# Altium schematic sheet pic.SchDoc
size A; DrawnBy: cc
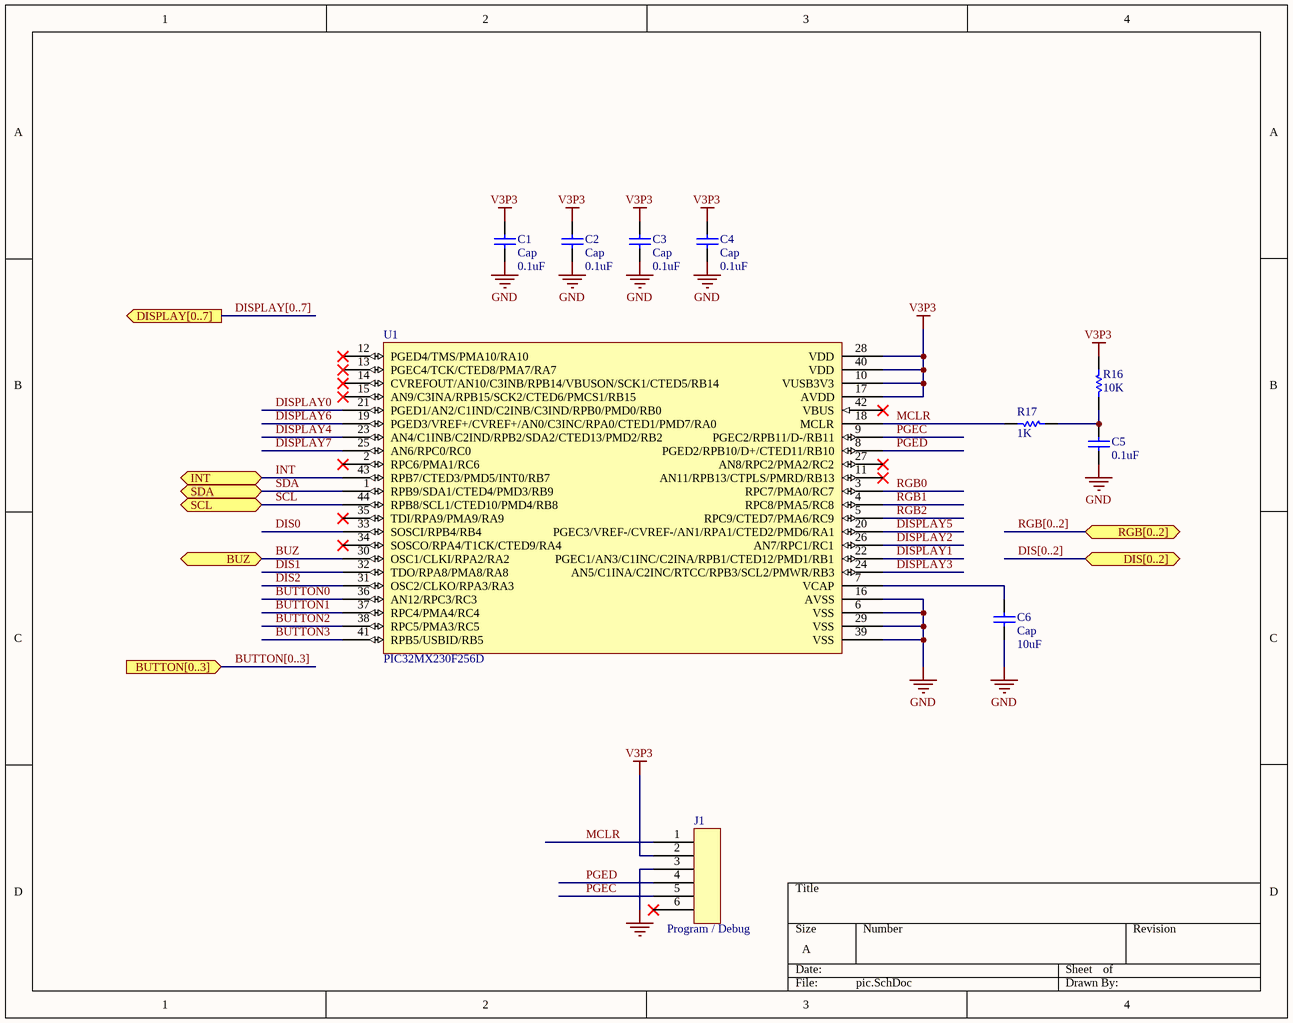
[diagram p0: pic.SchDoc]

## Parts
C1  Cap  value 0.1uF  [Capacitor]
C2  Cap  value 0.1uF  [Capacitor]
C3  Cap  value 0.1uF  [Capacitor]
C4  Cap  value 0.1uF  [Capacitor]
C5  value 0.1uF  [Capacitor]  (hidden comment: Cap)
C6  Cap  value 10uF  [Capacitor]
J1  Program / Debug  [ICSP]
R16  10K  [RESISTANCE]
R17  value 1K  [RESISTANCE]  (hidden comment: 10K)
U1  PIC32MX230F256D  [PIC32]

## Ports
BUTTON[0..3] (in), BUZ (bidir), DIS[0..2] (bidir), DISPLAY[0..7] (out), INT (bidir), RGB[0..2] (bidir), SCL (bidir), SDA (bidir)

## Nets
GND: C1.1 C2.1 C3.1 C4.1 C5.1 C6.1 J1.3 U1.6(VSS) U1.16(AVSS) U1.29(VSS) U1.39(VSS)
V3P3: C1.2 C2.2 C3.2 C4.2 J1.2 R16.2 U1.10(VUSB3V3) U1.17(AVDD) U1.28(VDD) U1.40(VDD)
BUTTON0: U1.36(AN12/RPC3/RC3)
BUTTON1: U1.37(RPC4/PMA4/RC4)
BUTTON2: U1.38(RPC5/PMA3/RC5)
BUTTON3: U1.41(RPB5/USBID/RB5)
BUZ: U1.30(OSC1/CLKI/RPA2/RA2) ; port BUZ
DIS0: U1.33(SOSCI/RPB4/RB4)
DIS1: U1.32(TDO/RPA8/PMA8/RA8)
DIS2: U1.31(OSC2/CLKO/RPA3/RA3)
DISPLAY0: U1.21(PGED1/AN2/C1IND/C2INB/C3IND/RPB0/PMD0/RB0)
DISPLAY1: U1.22(PGEC1/AN3/C1INC/C2INA/RPB1/CTED12/PMD1/RB1)
DISPLAY2: U1.26(AN7/RPC1/RC1)
DISPLAY3: U1.24(AN5/C1INA/C2INC/RTCC/RPB3/SCL2/PMWR/RB3)
DISPLAY4: U1.23(AN4/C1INB/C2IND/RPB2/SDA2/CTED13/PMD2/RB2)
DISPLAY5: U1.20(PGEC3/VREF-/CVREF-/AN1/RPA1/CTED2/PMD6/RA1)
DISPLAY6: U1.19(PGED3/VREF+/CVREF+/AN0/C3INC/RPA0/CTED1/PMD7/RA0)
DISPLAY7: U1.25(AN6/RPC0/RC0)
INT: U1.43(RPB7/CTED3/PMD5/INT0/RB7) ; port INT
MCLR: J1.1 R17.1 U1.18(MCLR)
PGEC: J1.5 U1.9(PGEC2/RPB11/D-/RB11)
PGED: J1.4 U1.8(PGED2/RPB10/D+/CTED11/RB10)
RGB0: U1.3(RPC7/PMA0/RC7)
RGB1: U1.4(RPC8/PMA5/RC8)
RGB2: U1.5(RPC9/CTED7/PMA6/RC9)
SCL: U1.44(RPB8/SCL1/CTED10/PMD4/RB8) ; port SCL
SDA: U1.1(RPB9/SDA1/CTED4/PMD3/RB9) ; port SDA
NetC5_2: C5.2 R16.1 R17.2
NetC6_2: C6.2 U1.7(VCAP)

Not connected (* = marked no-connect by the designer): J1 6*; U1 2(RPC6/PMA1/RC6)* 11(AN11/RPB13/CTPLS/PMRD/RB13)* 12(PGED4/TMS/PMA10/RA10)* 13(PGEC4/TCK/CTED8/PMA7/RA7)* 14(CVREFOUT/AN10/C3INB/RPB14/VBUSON/SCK1/CTED5/RB14)* 15(AN9/C3INA/RPB15/SCK2/CTED6/PMCS1/RB15)* 27(AN8/RPC2/PMA2/RC2)* 34(SOSCO/RPA4/T1CK/CTED9/RA4)* 35(TDI/RPA9/PMA9/RA9)* 42(VBUS)*

## Buses and harness runs
bus BUTTON[0..3] = port BUTTON[0..3]
bus DIS[0..2] = port DIS[0..2]
bus DISPLAY[0..7] = port DISPLAY[0..7]
bus RGB[0..2] = port RGB[0..2]

## Library data of the parts
C1-C6 = Cap: Capacitor; Published: 8-Jun-2000; LatestRevisionDate: 17-Jul-2002; LatestRevisionNote: Re-released for DXP Platform.; PackageReference: RAD-0.3; Publisher: Altium Limited; PackageDescription: Radial Cap, Thru-Hole; 2 Leads; 0.3 in Pin Spacing
J1 = CON6: Fabricant: Molex; Ref. fabricant: *; Fournisseur: *; Ref. fournisseur: *
R16 = Res1: Resistor; Value: 1K; Published: 8-Jun-2000; LatestRevisionDate: 17-Jul-2002; LatestRevisionNote: Re-released for DXP Platform.; PackageReference: AXIAL-0.3; Publisher: Altium Limited; PackageDescription: Axial Device, Thru-Hole; 2 Leads; 0.3 in Pin Spacing
R17 = Res1: Resistor; Published: 8-Jun-2000; LatestRevisionDate: 17-Jul-2002; LatestRevisionNote: Re-released for DXP Platform.; PackageReference: AXIAL-0.3; Publisher: Altium Limited; PackageDescription: Axial Device, Thru-Hole; 2 Leads; 0.3 in Pin Spacing
U1 = PIC32MX230F256D: Fournisseur: Farnell; Fabricant: Microchip; Ref. fournisseur: 2496725; Ref. fabricant: PIC32MX230F256D-I/PT